# EasyEDA Pro project Summer Robot.eprj, schematic Schematic4
Board Name: I2C Bus; Create Date: 2026-06-13; Page Name: P1; Project Name: Summer Robot; Schematic Name: Schematic4; Update Date: 2026-06-13; Company: EasyEDA.com; Page Size: A4; Version: V1.0
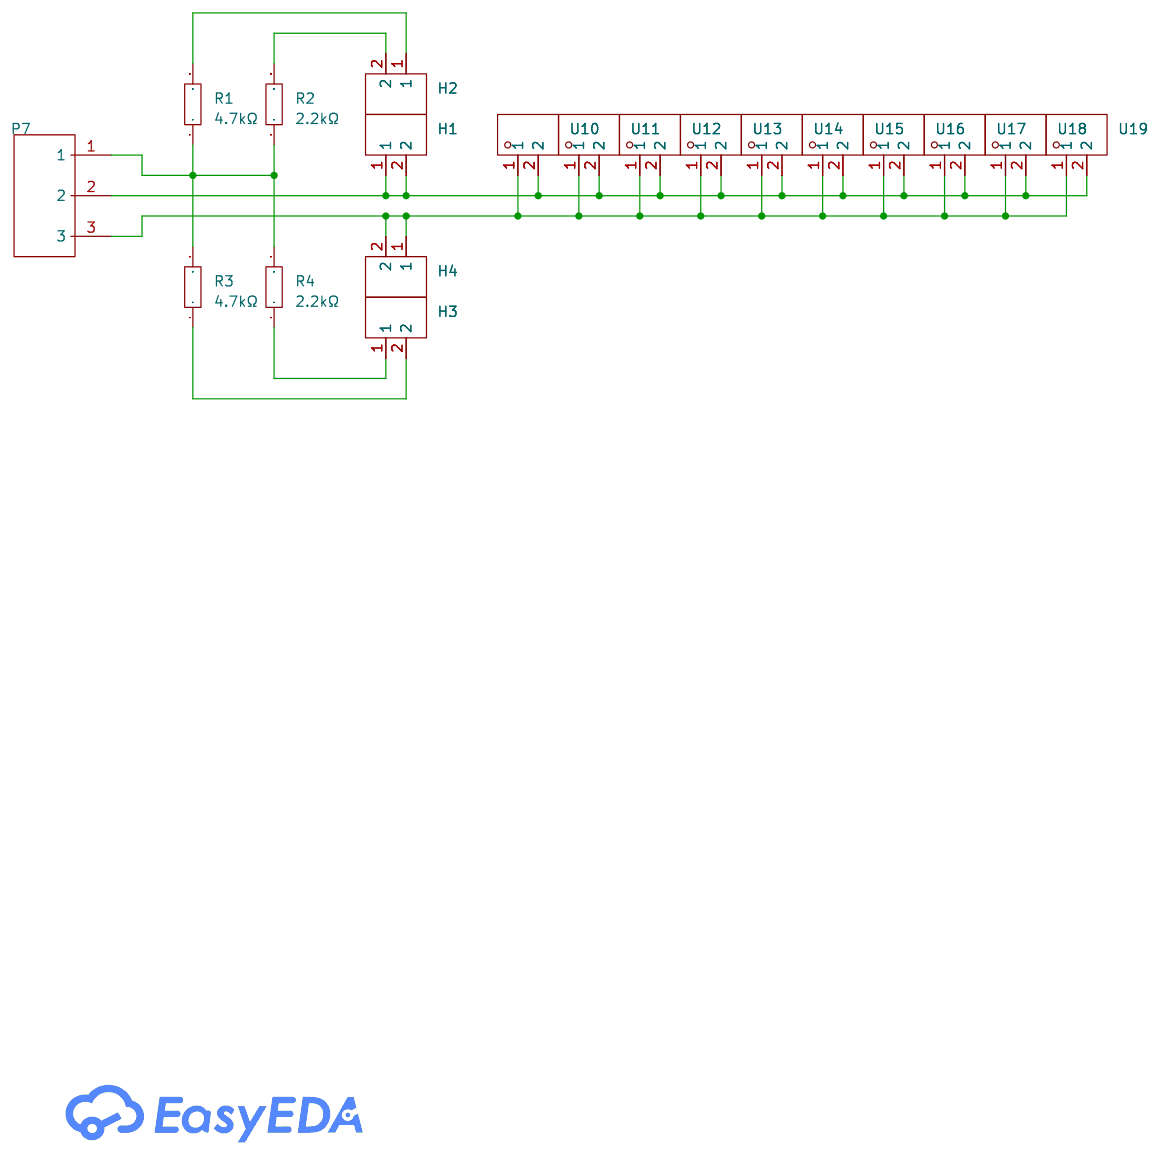
[diagram p9: schematic sheet]

## Parts
H1  HX PH254-01-02-Z-L11.5 male header connector  [HDR-TH_2P-P2.54-V-M]
H2  HX PH254-01-02-Z-L11.5 male header connector  [HDR-TH_2P-P2.54-V-M]
H3  HX PH254-01-02-Z-L11.5 male header connector  [HDR-TH_2P-P2.54-V-M]
H4  HX PH254-01-02-Z-L11.5 male header connector  [HDR-TH_2P-P2.54-V-M]
P7  WJ126V-5.0-03P-14-00A  [CONN-TH_3P-P5.00_WJ126V-5.0-3P]
R1  4.7kΩ  [R_AXIAL-0.4]
R2  2.2kΩ  [R_AXIAL-0.4]
R3  4.7kΩ  [R_AXIAL-0.4]
R4  2.2kΩ  [R_AXIAL-0.4]
U10  WJ126V-5.0-2P-16-00A  [CONN-TH_WJ126V-5.0-2P]
U11  WJ126V-5.0-2P-16-00A  [CONN-TH_WJ126V-5.0-2P]
U12  WJ126V-5.0-2P-16-00A  [CONN-TH_WJ126V-5.0-2P]
U13  WJ126V-5.0-2P-16-00A  [CONN-TH_WJ126V-5.0-2P]
U14  WJ126V-5.0-2P-16-00A  [CONN-TH_WJ126V-5.0-2P]
U15  WJ126V-5.0-2P-16-00A  [CONN-TH_WJ126V-5.0-2P]
U16  WJ126V-5.0-2P-16-00A  [CONN-TH_WJ126V-5.0-2P]
U17  WJ126V-5.0-2P-16-00A  [CONN-TH_WJ126V-5.0-2P]
U18  WJ126V-5.0-2P-16-00A  [CONN-TH_WJ126V-5.0-2P]
U19  WJ126V-5.0-2P-16-00A  [CONN-TH_WJ126V-5.0-2P]

## Library data of the parts
H1-H4 = HX PH254-01-02-Z-L11.5 male header connector: LCSC Part Name: 1x2P 间距:2.54mm 方针 直插; Supplier Part: C52016390; Manufacturer: hanxia(韩下); Supplier Footprint: 插件,P=2.54mm; JLCPCB Part Class: Extended Part; Datasheet: https://item.szlcsc.com/datasheet/HX%2520PH254-01-02-Z-L11.5%2520male%2520header%2520connector/54760435.html; Supplier: LCSC; Pin Structure: 1x2P; Pitch: 2.54mm; Circluar Pins/Square Pins: Pin Header; Mounting Type: Through Hole; Number of Rows: 1; Number of Pins: 2P; Current Rating: 3A; Voltage Rating (Max): 1kV; Length of Mating Pin: 6mm; Insulation Height: 2.5mm; Length of End Connection Pin: 3mm; Contact Material: Brass; Contact Plating: Gold; Operating Temperature: -40℃~+105℃
P7 = WJ126V-5.0-03P-14-00A: LCSC Part Name: 1x3P 5mm 直插 排数:1 每排P数:3; Supplier Part: C8401; Manufacturer: KANGNEX(康奈克斯电气); Supplier Footprint: 插件,P=5mm; JLCPCB Part Class: Extended Part; Datasheet: https://item.szlcsc.com/datasheet/WJ126V-5.0-03P-14-00A/8895.html; Supplier: LCSC; Number of Positions or Pins: 1x3P; Pitch: 5mm; Color: Green; Mounting Type: Through Hole; Number of Pins: 3P; Number of Rows: 1; Number of PINs Per Row: 3; Current Rating: 18A; Voltage Rating (Max): 250V; Wire Gauge - AWG: 14~26; Wire Gauge - mm2: 2.5; Operating Temperature: -40℃~+105℃
R1-R4 = Res_AXIAL-1/4W: Supplier Footprint: Through
U10-U19 = WJ126V-5.0-2P-16-00A: LCSC Part Name: 直插式/5.0mm 2P 红色; Supplier Part: C3031437; Manufacturer: KANGNEX(康奈克斯电气); Supplier Footprint: P=5mm; JLCPCB Part Class: Extended Part; Datasheet: https://atta.szlcsc.com/upload/public/pdf/source/20191225/C8379_3D37D98EF6F0ECCD8D2EB72C93E46299.pdf; Supplier: LCSC

## Nets
$1N518: H2.2 R2.2
$1N524: H2.1 R1.2
$1N2236: H1.1 H1.2 P7.2 U10.2 U11.2 U12.2 U13.2 U14.2 U15.2 U16.2 U17.2 U18.2 U19.2
$1N2305: H4.1 H4.2 P7.3 U10.1 U11.1 U12.1 U13.1 U14.1 U15.1 U16.1 U17.1 U18.1 U19.1
$1N2493: H3.1 R4.1
$1N2499: H3.2 R3.1
$1N2506: P7.1 R1.1 R2.1 R3.2 R4.2
